# EAGLE design Charging dock 2.1 (EAGLE 9.0.0)
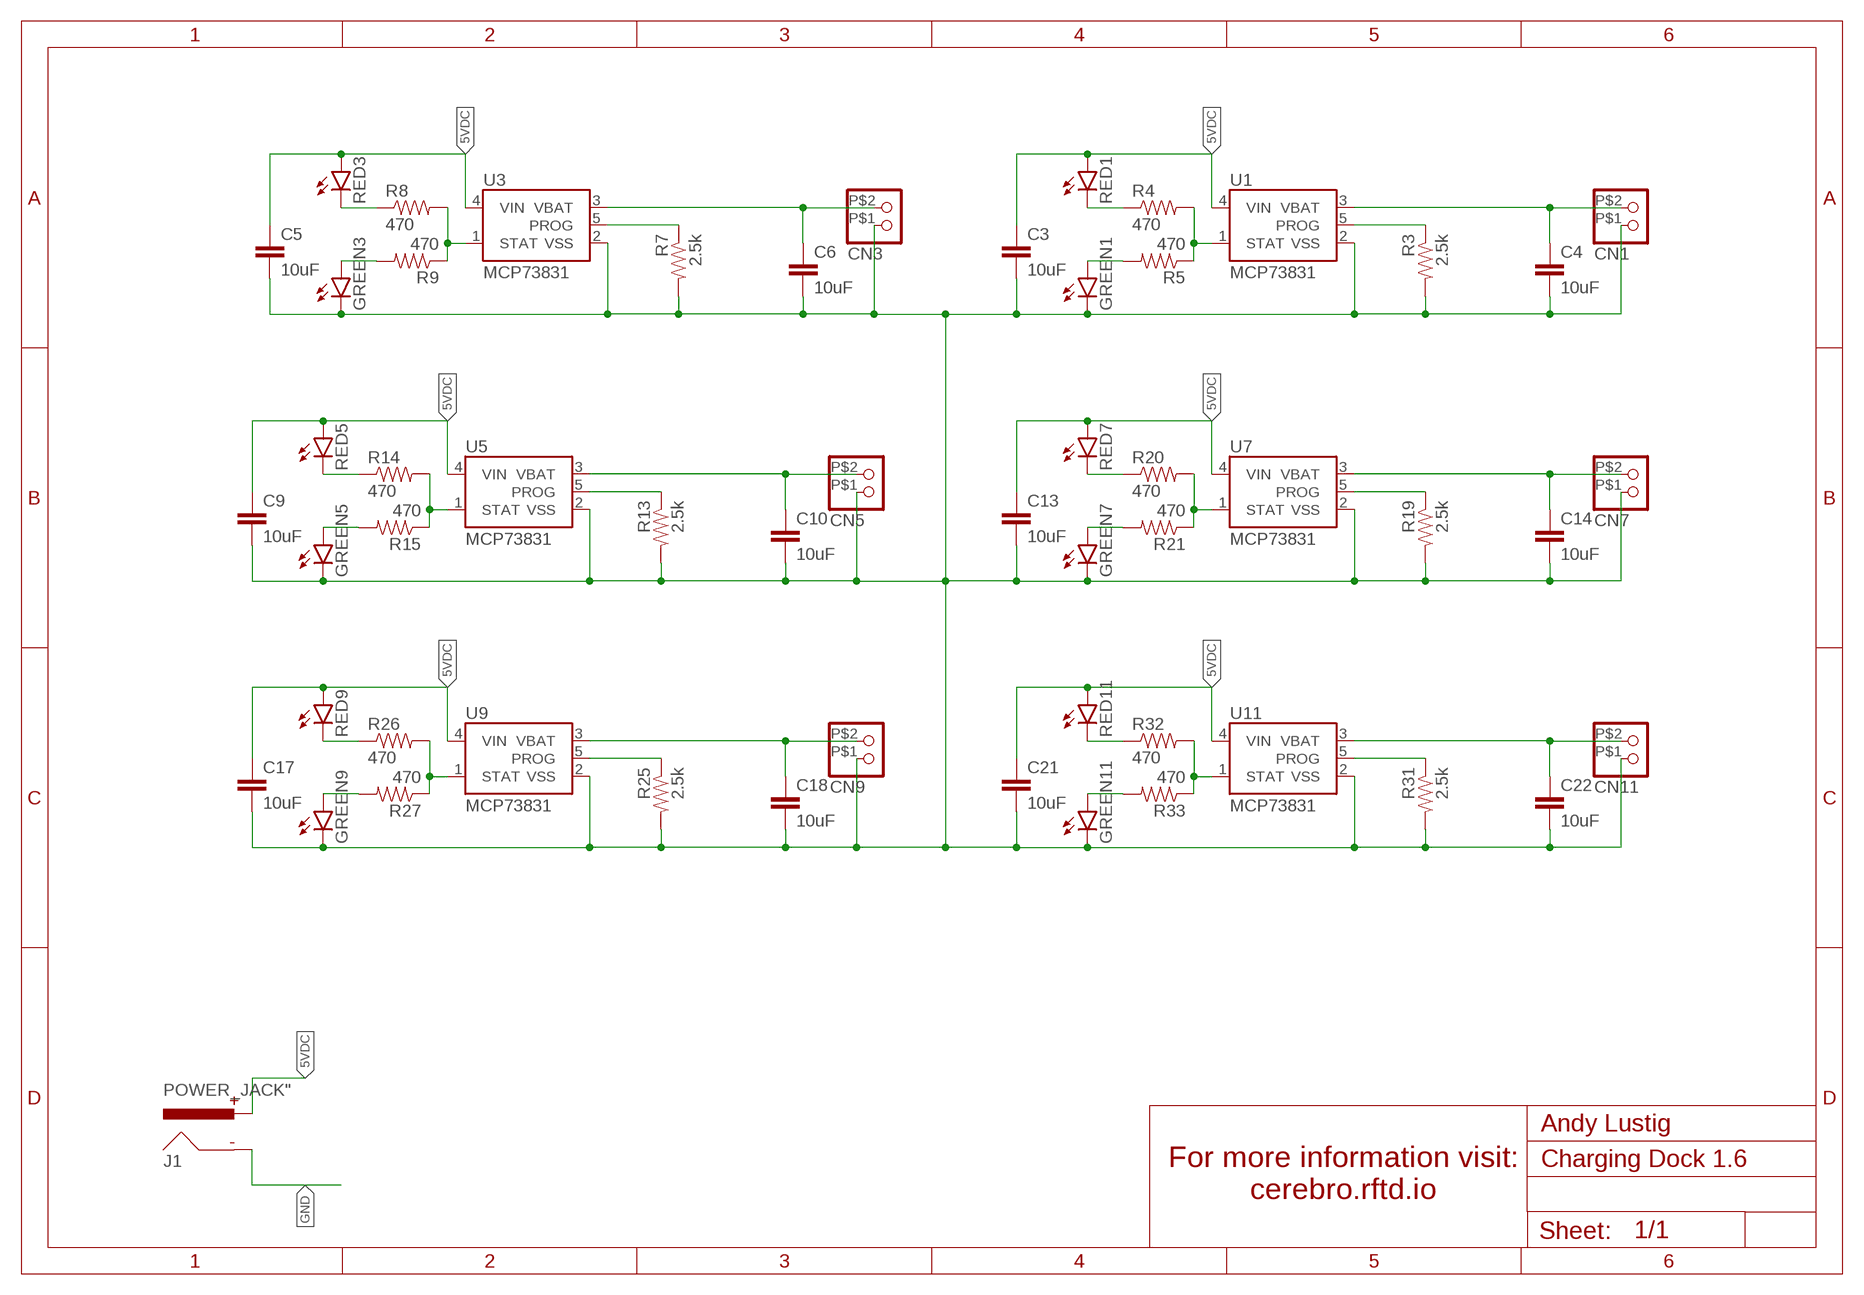
[diagram p0: schematic, sheet 1]

## Parts
C3  10uF  10UF-0805-10V-10%  [0805]
C4  10uF  10UF-0805-10V-10%  [0805]
C5  10uF  10UF-0805-10V-10%  [0805]
C6  10uF  10UF-0805-10V-10%  [0805]
C9  10uF  10UF-0805-10V-10%  [0805]
C10  10uF  10UF-0805-10V-10%  [0805]
C13  10uF  10UF-0805-10V-10%  [0805]
C14  10uF  10UF-0805-10V-10%  [0805]
C17  10uF  10UF-0805-10V-10%  [0805]
C18  10uF  10UF-0805-10V-10%  [0805]
C21  10uF  10UF-0805-10V-10%  [0805]
C22  10uF  10UF-0805-10V-10%  [0805]
CN1  JST_2PINMICRO  [MICRO_LOCK_2PIN]
CN3  JST_2PINMICRO  [MICRO_LOCK_2PIN]
CN5  JST_2PINMICRO  [MICRO_LOCK_2PIN]
CN7  JST_2PINMICRO  [MICRO_LOCK_2PIN]
CN9  JST_2PINMICRO  [MICRO_LOCK_2PIN]
CN11  JST_2PINMICRO  [MICRO_LOCK_2PIN]
GREEN1  LED3MM  [LED3MM]
GREEN3  LED3MM  [LED3MM]
GREEN5  LED3MM  [LED3MM]
GREEN7  LED3MM  [LED3MM]
GREEN9  LED3MM  [LED3MM]
GREEN11  LED3MM  [LED3MM]
J1  POWER_JACK"  [BARREL_CONN]
R3  2.5k  RESISTOR0805-RES  [0805]
R4  470  RESISTOR0805-RES  [0805]
R5  470  RESISTOR0805-RES  [0805]
R7  2.5k  RESISTOR0805-RES  [0805]
R8  470  RESISTOR0805-RES  [0805]
R9  470  RESISTOR0805-RES  [0805]
R13  2.5k  RESISTOR0805-RES  [0805]
R14  470  RESISTOR0805-RES  [0805]
R15  470  RESISTOR0805-RES  [0805]
R19  2.5k  RESISTOR0805-RES  [0805]
R20  470  RESISTOR0805-RES  [0805]
R21  470  RESISTOR0805-RES  [0805]
R25  2.5k  RESISTOR0805-RES  [0805]
R26  470  RESISTOR0805-RES  [0805]
R27  470  RESISTOR0805-RES  [0805]
R31  2.5k  RESISTOR0805-RES  [0805]
R32  470  RESISTOR0805-RES  [0805]
R33  470  RESISTOR0805-RES  [0805]
RED1  LED3MM  [LED3MM]
RED3  LED3MM  [LED3MM]
RED5  LED3MM  [LED3MM]
RED7  LED3MM  [LED3MM]
RED9  LED3MM  [LED3MM]
RED11  LED3MM  [LED3MM]
U1  MCP73831  [SOT23-5]
U3  MCP73831  [SOT23-5]
U5  MCP73831  [SOT23-5]
U7  MCP73831  [SOT23-5]
U9  MCP73831  [SOT23-5]
U11  MCP73831  [SOT23-5]

## Nets
5VDC: C3.1 C5.1 C9.1 C13.1 C17.1 C21.1 J1.PWR RED1.A RED3.A RED5.A RED7.A RED9.A RED11.A U1.4(VIN) U3.4(VIN) U5.4(VIN) U7.4(VIN) U9.4(VIN) U11.4(VIN)
GND: C3.2 C4.2 C5.2 C6.2 C9.2 C10.2 C13.2 C14.2 C17.2 C18.2 C21.2 C22.2 CN1.P$1 CN3.P$1 CN5.P$1 CN7.P$1 CN9.P$1 CN11.P$1 GREEN1.K(C) GREEN3.K(C) GREEN5.K(C) GREEN7.K(C) GREEN9.K(C) GREEN11.K(C) J1.GND R3.2 R7.2 R13.2 R19.2 R25.2 R31.2 U1.2(VSS) U3.2(VSS) U5.2(VSS) U7.2(VSS) U9.2(VSS) U11.2(VSS)
N$4: R3.1 U1.5(PROG)
N$5: R4.1 RED1.K(C)
N$6: R4.2 R5.1 U1.1(STAT)
N$9: GREEN1.A R5.2
N$10: R7.1 U3.5(PROG)
N$11: R8.1 RED3.K(C)
N$12: R8.2 R9.1 U3.1(STAT)
N$13: GREEN3.A R9.2
N$18: R13.1 U5.5(PROG)
N$19: R14.1 RED5.K(C)
N$20: R14.2 R15.1 U5.1(STAT)
N$21: GREEN5.A R15.2
N$26: R19.1 U7.5(PROG)
N$27: R20.1 RED7.K(C)
N$28: R20.2 R21.1 U7.1(STAT)
N$29: GREEN7.A R21.2
N$34: R25.1 U9.5(PROG)
N$35: R26.1 RED9.K(C)
N$36: R26.2 R27.1 U9.1(STAT)
N$37: GREEN9.A R27.2
N$42: R31.1 U11.5(PROG)
N$43: R32.1 RED11.K(C)
N$44: R32.2 R33.1 U11.1(STAT)
N$45: GREEN11.A R33.2
NW_CHARGE1: C4.1 CN1.P$2 U1.3(VBAT)
NW_CHARGE3: C6.1 CN3.P$2 U3.3(VBAT)
NW_CHARGE5: C10.1 CN5.P$2 U5.3(VBAT)
NW_CHARGE7: C14.1 CN7.P$2 U7.3(VBAT)
NW_CHARGE9: C18.1 CN9.P$2 U9.3(VBAT)
NW_CHARGE11: C22.1 CN11.P$2 U11.3(VBAT)

## Library data of the parts
C3-C6 C9 C10 C13 C14 C17 C18 C21 C22 = Cerebro-library:10UF: 10.0µF ceramic capacitors A capacitor is a passive two-terminal electrical component used to store electrical energy temporarily in an electric field.; PROD_ID: CAP-11330
CN1 CN3 CN5 CN7 CN9 CN11 = Cerebro-library:JST_2PIN: JST 2-Pin Connectors of various flavors SMT-RA (S2B-PH-SM4) 4UConnector #17311 SMT (B2B-PH-SM4) THM-RA (S2B-PH) THM (B2B-PH)
GREEN1 GREEN3 GREEN5 GREEN7 GREEN9 GREEN11 RED1 RED3 RED5 RED7 RED9 RED11 = Andy-library:LED: LEDs Standard schematic elements and footprints for 5mm, 3mm, 1206, and 0603 sized LEDs. 5mm - Spark Fun Electronics SKU : COM-00529 (and others)
J1 = Andy-library:POWER_JACK: 5mm Barrel Power Connector CP-037A-ND <http://www.digikey.com/product-detail/en/cui-inc/PJ-037A/CP-037A-ND/1644545>; DIGIKEY_PN: CP-037A-ND; MANUFACTURER: CUI Inc; MFG_PN: PJ-037A
R3 R7 R13 R19 R25 R31 = Andy-library:RESISTOR: Resistor Basic schematic elements and footprints for 0603, 1206, and PTH resistors.
R4 R5 R8 R9 R14 R15 R20 R21 R26 R27 R32 R33 = Cerebro-library:RESISTOR: Resistor Basic schematic elements and footprints for 0603, 1206, and PTH resistors.
U1 U3 U5 U7 U9 U11 = SparkFun-PowerIC:MCP73831: Miniature single cell, fully integrated Li-Ion, Li-polymer charge management controller http://ww1.microchip.com/downloads/en/DeviceDoc/20001984g.pdf IC-09995; PROD_ID: IC-09995

## Net classes
0 default: width 0.254 mm, clearance 0.254 mm
1 power: width 0.61 mm, drill 0.61 mm, clearance 0.254 mm
2 gnd: width 0.305 mm, drill 0.559 mm, clearance 0.254 mm
3 usbvcc: width 0.508 mm, drill 0.61 mm, clearance 0.254 mm
4 aref: width 0.406 mm, drill 0.61 mm, clearance 0.254 mm

## Board
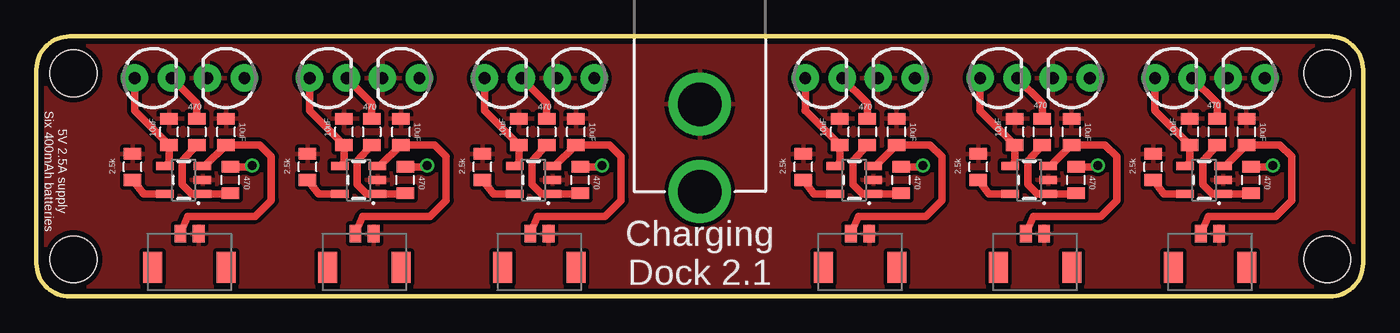
[diagram p1: board, top side]
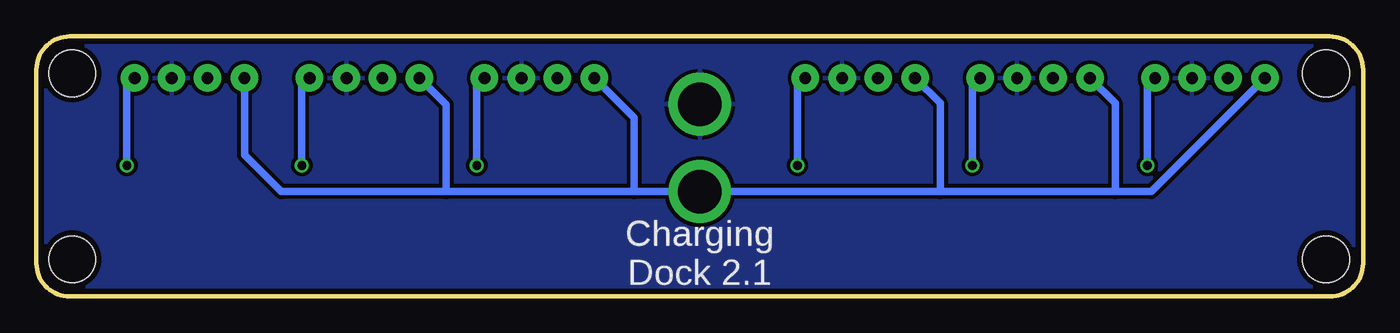
[diagram p2: board, bottom side, seen from below]

Size 91 x 17.86 mm. Coordinates in mm from the lower left corner, seen from the top.
Outline: 0,2.27 0,15.59 arc-90 2.27,17.86 88.73,17.86 arc-90 91,15.59 91,2.27 arc-90 88.73,0 2.27,0 arc-90 0,2.27
Copper layers (1*16): Top 0.0356mm / dielectric 1.5011mm / Bottom 0.0356mm
Design rules "LaenPCBOrder": minimum track width 6mil, minimum drill 13mil, track to track 6mil, track to pad 6mil, pad to pad 6mil, via to via 6mil, smd to smd 6mil, copper to edge 15mil, drill to drill 6mil, minimum pad ring 7mil, minimum via ring 7mil, stop-mask expansion 3mil, vias tented up to drill 0mil, thermal gap 10mil
Holes 3.2 mm at 2.54,15.32 2.54,2.54 88.55,15.32 88.55,2.54

### Footprints (pad centres in the part's own frame; a part is rotated, then mirrored left to right if it is on the bottom)
0805 = smd 0.8 x 1.2: 1 -0.9,0; 2 0.9,0
MICRO_LOCK_2PIN = smd 0.8 x 1.2: P$1 -0.625,0; P$2 0.625,0 | smd 1.3 x 2.15: P$3 -2.525,2.295; P$4 2.525,2.295
LED3MM = drill 0.813 pad 1.88: A -1.27,0; K 1.27,0
BARREL_CONN = drill 2.997 pad 4.318: GND 0,7.7; PWR 0,13.7
SOT23-5 = smd 0.55 x 1.2: 1 -0.95,-1.3; 2 0,-1.3; 3 0.95,-1.3; 4 0.95,1.3; 5 -0.95,1.3

### Placement (x,y rotation side)
C3  21.1,11.3 90 top
C4  25,11.3 90 top
C5  9.1,11.3 90 top
C6  13,11.3 90 top
C9  33.1,11.3 90 top
C10  37,11.3 90 top
C13  55.1,11.3 90 top
C14  59,11.3 90 top
C17  67.1,11.3 90 top
C18  71,11.3 90 top
C21  79.1,11.3 90 top
C22  83,11.3 90 top
CN1  22.5,4.3 180 top
CN3  10.5,4.3 180 top
CN5  34.5,4.3 180 top
CN7  56.5,4.3 180 top
CN9  68.5,4.3 180 top
CN11  80.5,4.3 180 top
GREEN1  25,15 180 top
GREEN3  13,15 180 top
GREEN5  37,15 180 top
GREEN7  59,15 180 top
GREEN9  71,15 180 top
GREEN11  83,15 180 top
J1  45.5,20.9 180 top
R3  18.6,8.9 90 top
R4  23,11.3 270 top
R5  25.3,8 90 top
R7  6.6,8.9 90 top
R8  11,11.3 270 top
R9  13.3,8 90 top
R13  30.6,8.9 90 top
R14  35,11.3 270 top
R15  37.3,8 90 top
R19  52.6,8.9 90 top
R20  57,11.3 270 top
R21  59.3,8 90 top
R25  64.6,8.9 90 top
R26  69,11.3 270 top
R27  71.3,8 90 top
R31  76.6,8.9 90 top
R32  81,11.3 270 top
R33  83.3,8 90 top
RED1  20,15 0 top
RED3  8,15 0 top
RED5  32,15 0 top
RED7  54,15 0 top
RED9  66,15 0 top
RED11  78,15 0 top
U1  22.1,8 90 top
U3  10.1,8 90 top
U5  34.1,8 90 top
U7  56.1,8 90 top
U9  68.1,8 90 top
U11  80.1,8 90 top

### Tracks (layer width: path | path; a pad name or v marks a point on that pad's centre or on a via)
5VDC
  Top 0.508: U1.4 21.1,9.25 C3.1 18.75,12.75 | 18.75,12.75 18.73,12.77 | U3.4 9.1,9.25 C5.1 6.73,12.77 RED3.A | U5.4 33.1,9.25 C9.1 30.73,12.77 RED5.A | U7.4 55.1,9.25 C13.1 52.75,12.75 | 52.75,12.75 52.73,12.77 | U9.4 67.1,9.25 C17.1 64.73,12.77 RED9.A | U11.4 79.1,9.25 C21.1 76.73,12.77 RED11.A | 52.75,12.75 52.75,14.98 RED7.A | 18.75,12.75 18.75,14.98 RED1.A
  Bottom 0.508: RED3.A 14.53,7.2 17,7.2 | 17,7.2 29,7.2 | 29,7.2 J1.PWR 50,7.2 | RED1.A 17,13.27 17,7.2 | RED5.A 29,13.27 29,7.2 | 50,7.2 62.9,7.2 | 62.9,7.2 74.2,7.2 76.73,9.73 RED11.A | RED7.A 50,12.27 50,7.2 | RED9.A 62.9,13.17 62.9,7.2
GND
  pour Bottom: 91.09,17.86 91.09,0 0,0 0,17.86
  pour Top: 91.09,17.86 91.09,0 0,0 0,17.86
N$4
  Top 0.508: U1.5 19.35,7.05 R3.1
N$5
  Top 0.508: R4.1 23,13.27 RED1.K
N$6
  Top 0.508: R5.1 25.05,7.05 U1.1 22.65,7.05 22,7.7 22,9.3 R4.2
N$9  (via drill 0.6)
  Top 0.508: R5.2 26.7,8.9 v26.8,9
  Bottom 0.508: v26.8,9 26.8,14.47 GREEN1.A
N$10
  Top 0.508: U3.5 7.35,7.05 R7.1
N$11
  Top 0.508: R8.1 11,13.27 RED3.K
N$12
  Top 0.508: R9.1 13.05,7.05 U3.1 10.65,7.05 10,7.7 10,9.3 R8.2
N$13  (via drill 0.6)
  Top 0.508: R9.2 14.7,8.9 v14.8,9
  Bottom 0.508: v14.8,9 14.8,14.47 GREEN3.A
N$18
  Top 0.508: U5.5 31.35,7.05 R13.1
N$19
  Top 0.508: R14.1 35,13.27 RED5.K
N$20
  Top 0.508: R15.1 37.05,7.05 U5.1 34.65,7.05 34,7.7 34,9.3 R14.2
N$21  (via drill 0.6)
  Top 0.508: R15.2 38.7,8.9 v38.8,9
  Bottom 0.508: v38.8,9 38.8,14.47 GREEN5.A
N$26
  Top 0.508: U7.5 53.35,7.05 R19.1
N$27
  Top 0.508: R20.1 57,13.27 RED7.K
N$28
  Top 0.508: R21.1 59.05,7.05 U7.1 56.65,7.05 56,7.7 56,9.3 R20.2
N$29  (via drill 0.6)
  Top 0.508: R21.2 60.7,8.9 v60.8,9
  Bottom 0.508: v60.8,9 60.8,14.47 GREEN7.A
N$34
  Top 0.508: U9.5 65.35,7.05 R25.1
N$35
  Top 0.508: R26.1 69,13.27 RED9.K
N$36
  Top 0.508: R27.1 71.05,7.05 U9.1 68.65,7.05 68,7.7 68,9.3 R26.2
N$37  (via drill 0.6)
  Top 0.508: R27.2 72.7,8.9 v72.8,9
  Bottom 0.508: v72.8,9 72.8,14.47 GREEN9.A
N$42
  Top 0.508: U11.5 77.35,7.05 R31.1
N$43
  Top 0.508: R32.1 81,13.27 RED11.K
N$44
  Top 0.508: R33.1 83.05,7.05 U11.1 80.65,7.05 80,7.7 80,9.3 R32.2
N$45  (via drill 0.6)
  Top 0.508: R33.2 84.7,8.9 v84.8,9
  Bottom 0.508: v84.8,9 84.8,14.47 GREEN11.A
NW_CHARGE1
  Top 0.508: U1.3 23.55,8.95 C4.1 27.3,10.4 28.1,9.6 28.1,6.6 27,5.5 22.39,5.5 CN1.P$2
NW_CHARGE3
  Top 0.508: U3.3 11.55,8.95 C6.1 15.3,10.4 16.1,9.6 16.1,6.6 15,5.5 10.39,5.5 CN3.P$2
NW_CHARGE5
  Top 0.508: U5.3 35.55,8.95 C10.1 39.3,10.4 40.1,9.6 40.1,6.6 39,5.5 34.39,5.5 CN5.P$2
NW_CHARGE7
  Top 0.508: U7.3 57.55,8.95 C14.1 61.3,10.4 62.1,9.6 62.1,6.6 61,5.5 56.39,5.5 CN7.P$2
NW_CHARGE9
  Top 0.508: U9.3 69.55,8.95 C18.1 73.3,10.4 74.1,9.6 74.1,6.6 73,5.5 68.39,5.5 CN9.P$2
NW_CHARGE11
  Top 0.508: U11.3 81.55,8.95 C22.1 85.3,10.4 86.1,9.6 86.1,6.6 85,5.5 80.39,5.5 CN11.P$2

### Text on the board
tNames: 5V 2.5A supply / Six 400mAh batteries | Charging / Dock 2.1
bNames: Charging / Dock 2.1
214bmp: D:/SmartProjects/Snc/a4_bn_logo2.bmp